# Altium schematic sheet BatteryProtection.SchDoc
size A; SheetNumber: 2; SheetTotal: 2
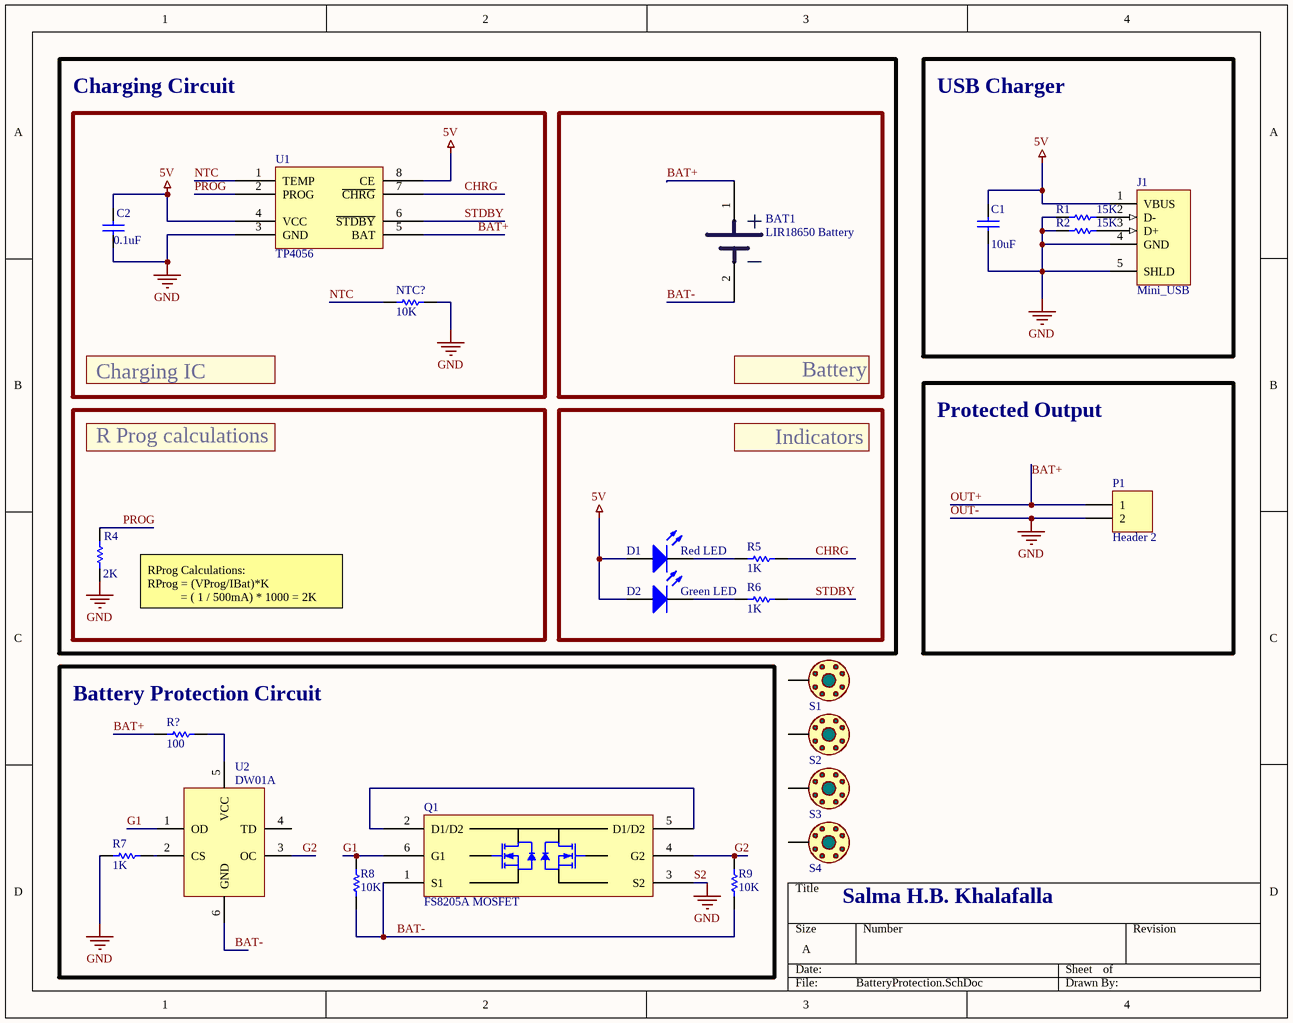
[diagram p0: BatteryProtection.SchDoc]

## Parts
BAT1  LIR18650 Battery  [MY_Lith_batt]
C1  10uF  [MY_0805]
C2  0.1uF  [MY_0805]
D1  Red LED  [MY_LED_0805]
D2  Green LED  [MY_LED_0805]
J1  Mini_USB  [My_USB]
NTC?  10K  [MY_0603]
P1  Header 2  [MY_MA02-1W]
Q1  FS8205A MOSFET  [MY_SOT23-6]
R1  15K  [MY_0805]
R2  15K  [MY_0805]
R4  2K  [MY_0805]
R5  1K  [MY_0805]
R6  1K  [MY_0805]
R7  1K  [MY_0805]
R8  10K  [MY_0805]
R9  10K  [MY_0805]
R?  100  [MY_0805]
S1  Screw  [MY_PAD_3MM]  (value not drawn)  (net tie, no BOM)
S2  Screw  [MY_PAD_3MM]  (value not drawn)  (net tie, no BOM)
S3  Screw  [MY_PAD_3MM]  (value not drawn)  (net tie, no BOM)
S4  Screw  [MY_PAD_3MM]  (value not drawn)  (net tie, no BOM)
U1  TP4056  [My_SOIC_P8]
U2  DW01A  [MY_SOT23-6]

## Blocks framed on the sheet
USB Charger: C1 J1 R1 R2
Battery: BAT1
Protected Output: P1
R Prog calculations: R4
Indicators: D1 D2 R5 R6
Battery Protection Circuit: Q1 R7-R9 R? U2

## Nets
5V: C1.1 C2.1 D1.A D2.A J1.1(VBUS) U1.4(VCC) U1.8(CE)
OUT-: C1.2 C2.2 J1.4(GND) J1.5(SHLD) NTC?.2 P1.2 Q1.3(S2) R1.1 R2.1 R4.2 R7.1 U1.3(GND)  [also labelled GND, S2]
BAT+: BAT1.1 P1.1 R?.1 U1.5(BAT)  [also labelled OUT+]
BAT-: BAT1.2 Q1.1(S1) R8.1 R9.1 U2.6(GND)
CHRG: R5.2 U1.7(~{CHRG})
G1: Q1.6(G1) R8.2 U2.1(OD)
G2: Q1.4(G2) R9.2 U2.3(OC)
NTC: NTC?.1 U1.1(TEMP)
PROG: R4.1 U1.2(PROG)
STDBY: R6.2 U1.6(~{STDBY})
NetD1_K: D1.K R5.1
NetD2_K: D2.K R6.1
NetJ1_2: J1.2(D-) R1.2
NetJ1_3: J1.3(D+) R2.2
NetQ1_2: Q1.2(D1/D2) Q1.5(D1/D2)
NetR7_2: R7.2 U2.2(CS)
NetR?_2: R?.2 U2.5(VCC)

Not connected (* = marked no-connect by the designer): S1 0; S2 0; S3 0; S4 0; U2 4(TD)

## Notes on the sheet
- Charging Circuit
- Charging IC
- (near R4) RProg Calculations:
  RProg = (VProg/IBat)*K
  = ( 1 / 500mA) * 1000 = 2K
- Salma H.B. Khalafalla

## Library data of the parts
BAT1 = LIR18650 Battery: Lithium-ion Battery
C1 C2 = Cap ceramic: None polar capacitor; ASiD Part Number: C-AS; Volte: 50v
  C1: Value: 10uF
  C2: Value: 0.1uF
D1 D2 = LED: Typical INFRARED GaAs LED; ASiD Part Number: LED-AS
J1 = Mini_USB: USB 2.0, Right Angle, SMT, B Type, Receptacle, 5 Position, Black; ASiD Part Number: Mini_USB-AS
NTC? = NTC thermistor
P1 = Header 2: Header, 2-Pin; ASiD Part Number: Header 2-AS
Q1 = FS8205A MOSFET: N-Channel Enhancement Mode MOSFET
R1 R2 R4-R9 R? = Res: Standard resistor; ASiD Part Number: Res-AS
  R1 R2: Value: 15K
  R4: Value: 2K
  R5-R7: Value: 1K
  R8 R9: Value: 10K
  R?: Value: 100
S1-S4 = Screw: 3mm Screw; ASiD Part Number: Screw-AS
U1 = TP4056: complete constant-current/constant-voltage linear charger for single cell / lithium-ion batteries. Its SOP package and low external component count make the TP4056 / ideally suited for portable applications. Furthermore, the TP4056 can work within USB and wall / adapter.